# Altium schematic sheet GDRIVE2.SchDoc
size A3
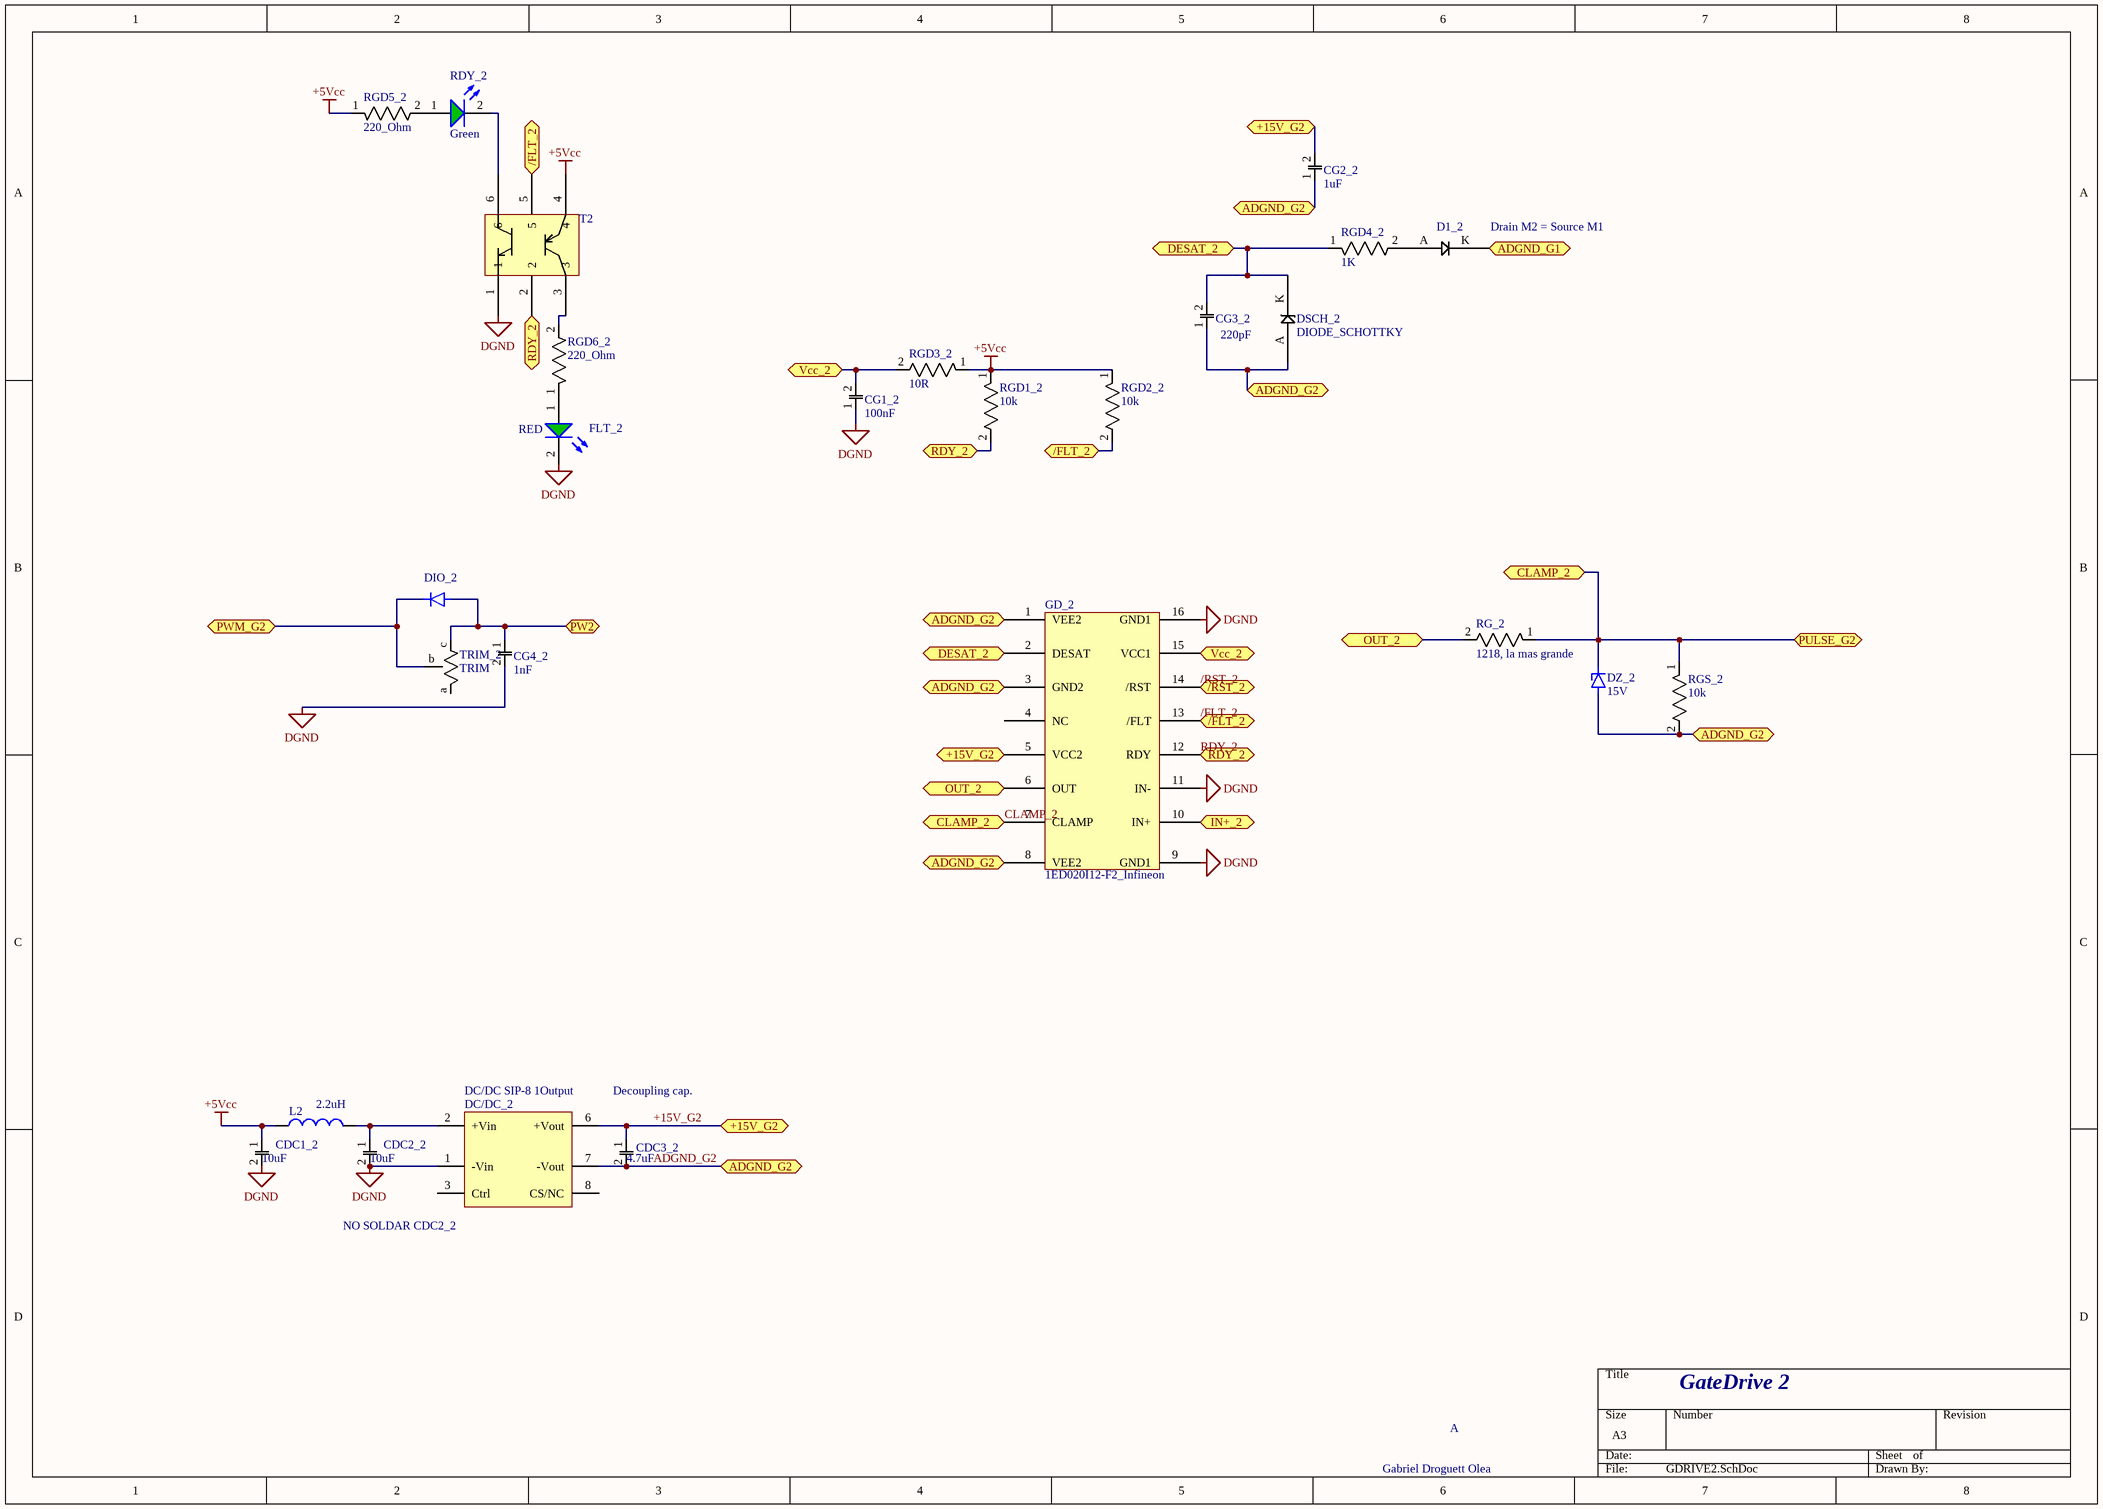
[diagram p0: GDRIVE2.SchDoc]

## Parts
CDC1_2  10uF  [C1206]
CDC2_2  10uF  [C1206]
CDC3_2  4.7uF  [C1206]
CG1_2  100nF  [CAP_0805_L]
CG2_2  1uF  [CAP_0603]
CG3_2  220pF  [CAP_0603]
CG4_2  1nF  [CAP_0805]
D1_2  DIODE  [DO-214AC]  (value not drawn)
DC/DC_2  DC/DC SIP-8 1Output  [DC/DC SIP-8]
DIO_2  DIOde  [DIO_BAS85-GS08]  (value not drawn)
DSCH_2  DIODE_SCHOTTKY  [SOD323W]
DZ_2  15V  [BZV55-C15,115]
FLT_2  RED  [LED_0805]
GD_2  1ED020I12-F2_Infineon  [SOIC_16W]
L2  2.2uH  [RES_0805]
RDY_2  Green  [LED_0805]
RG_2  1218, la mas grande  [RES_1218]
RGD1_2  10k  [0603]
RGD2_2  10k  [0603]
RGD3_2  10R  [RES_1206]
RGD4_2  1K  [RES_0805]
RGD5_2  220_Ohm  [res_0805]
RGD6_2  220_Ohm  [res_0805]
RGS_2  10k  [RES_1206]
T2  TRANS PREBIAS  [SOT363_]  (value not drawn)
TRIM_2  TRIM  [TRIM_TS53YJ203MR10]

## Ports
+15V_G2 (bidir), /FLT_2 (bidir), /RST_2 (bidir), ADGND_G1 (bidir), ADGND_G2 (bidir), CLAMP_2 (bidir), DESAT_2 (bidir), IN+_2 (bidir), OUT_2 (bidir), PULSE_G2 (bidir), PW2 (bidir), PWM_G2 (bidir), RDY_2 (bidir), Vcc_2 (bidir)

## Nets
+5Vcc: CDC1_2.1 L2.1 RGD1_2.1(C) RGD2_2.1(C) RGD3_2.1(C) RGD5_2.1(C) T2.4
DGND: CDC1_2.2 CDC2_2.2 CG1_2.1 CG4_2.2 DC/DC_2.1(-Vin) FLT_2.2(C) GD_2.9(GND1) GD_2.11(IN-) GD_2.16(GND1) T2.1
+15V_G2: CDC3_2.1 CG2_2.2 DC/DC_2.6(+Vout) GD_2.5(VCC2) ; port +15V_G2
/FLT_2: GD_2.13(/FLT) RGD2_2.2(A) T2.5 ; port /FLT_2
/RST_2: GD_2.14(/RST) ; port /RST_2
ADGND_G1: D1_2.K ; port ADGND_G1
ADGND_G2: CDC3_2.2 CG2_2.1 CG3_2.1 DC/DC_2.7(-Vout) DSCH_2.A DZ_2.2(Anodo) GD_2.1(VEE2) GD_2.3(GND2) GD_2.8(VEE2) RGS_2.2(A) ; port ADGND_G2
CLAMP_2: DZ_2.1(Catodo) GD_2.7(CLAMP) RG_2.1(C) RGS_2.1(C) ; port CLAMP_2, port PULSE_G2
DESAT_2: CG3_2.2 DSCH_2.K GD_2.2(DESAT) RGD4_2.1(C) ; port DESAT_2
IN+_2: GD_2.10(IN+) ; port IN+_2
OUT_2: GD_2.6(OUT) RG_2.2(A) ; port OUT_2
PW2: CG4_2.1 DIO_2.2(Anodo) TRIM_2.c ; port PW2
PWM_G2: DIO_2.1(Catodo) TRIM_2.b ; port PWM_G2
RDY_2: GD_2.12(RDY) RGD1_2.2(A) T2.2 ; port RDY_2
Vcc_2: CG1_2.2 GD_2.15(VCC1) RGD3_2.2(A) ; port Vcc_2
NetCDC2_2_1: CDC2_2.1 DC/DC_2.2(+Vin) L2.2
NetD1_2_A: D1_2.A RGD4_2.2(A)
NetFLT_2_1: FLT_2.1(A) RGD6_2.1(C)
NetRDY_2_1: RDY_2.1(A) RGD5_2.2(A)
NetRDY_2_2: RDY_2.2(C) T2.6
NetRGD6_2_2: RGD6_2.2(A) T2.3

Not connected (* = marked no-connect by the designer): DC/DC_2 3(Ctrl) 8(CS/NC); GD_2 4(NC); TRIM_2 a

## Notes on the sheet
- (near D1_2) Drain M2 = Source M1
- Decoupling cap.
- (near DC/DC_2) NO SOLDAR CDC2_2
- GateDrive 2
- A
- Gabriel Droguett Olea

## Library data of the parts
CDC1_2 CDC2_2 = CAP_C0805C105Z3VACTU: CAP CER 10UF 35V X6S 1206; Manufacturer Part Number: C3216X6S1V106K160AC; Digi-Key Part Number: 445-14778-1-ND; RS Part Number: 723-6647
CDC3_2 = CAP_C0805C105Z3VACTU: CAP CER 4.7UF 35V X7R 1206; Manufacturer Part Number: C3216X7R1V475K085AC; Digi-Key Part Number: 445-14805-1-ND; RS Part Number: *
CG1_2 = CAP_0603YC104KAT2A: CAP CER 0.1UF 50V X7R 0805; Manufacturer Part Number: 08055C104KAT2A; Digi-Key Part Number: 478-1395-1-ND; RS Part Number: *
CG2_2 = CAP_0603YC104KAT2A: CAP CER 1UF 50V X5R 0603; Manufacturer Part Number: CGA3E3X5R1H105K080AB; Digi-Key Part Number: 445-7878-1-ND; RS Part Number: *
CG3_2 = CAP_0603YC104KAT2A: CAP CER 220PF 50V C0G/NP0 0603; Manufacturer Part Number: C0603C221F5GACTU; Digi-Key Part Number: 399-7876-1-ND; RS Part Number: *
CG4_2 = CAP_C0805C102J5GACTU: CAP CER 1000PF 50V C0G/NP0 0805; Digi-Key Part Number: 399-1136-1-ND; Manufacturer Part Number: C0805C102J5GACTU; RS Part Number: *
D1_2 = DIODE: DIODE GEN PURP 1KV 1A SMA; Manufacturer Part Number: RS1MTR; Digi-Key Part Number: 1655-1501-1-ND; RS Part Number: *
DIO_2 = DIO_BAS85-GS08: DIODE SCHOTTKY 30V 200MA SOD80; Digi-Key Part Number: BAS85-GS08CT-ND; Manufacturer Part Number: BAS85-GS08; RS Part Number: *
DSCH_2 = DIODE_SCHOTTKY: DIODE SCHOTTKY 40V 750MA SOD323; Manufacturer Part Number: BAT165E6327HTSA1; Digi-Key Part Number: BAT165E6327HTSA1CT-ND; RS Part Number: *
DZ_2 = DIO_BZV55-C15,115: DIODE ZENER 15V 500MW SOD80C; Digi-Key Part Number: 1727-4962-1-ND; Manufacturer Part Number: BZV55-C15,115; RS Part Number: 484-3227
FLT_2 RDY_2 = WL-SMCW 0805  150080GS75000: LED RED CLEAR 0805 SMD; Manufacturer Part Number: 150080RS75000
  FLT_2: Digi-Key Part Number: 732-4984-1-ND; RS Part Number: 815-4225
  RDY_2: Digi-Key Part Number: 732-4986-1-ND
GD_2 = 1ED020I12-F2_Infineon: IC IGBT DVR 1200V 2A DSO16; Manufacturer Part Number: 1ED020I12F2XUMA1; Digi-Key Part Number: 1ED020I12F2XUMA1CT-ND; RS Part Number: 110-9111
L2 = Inductor: FIXED IND 2.2UH 600MA 160 MOHM; Manufacturer Part Number: MLZ2012M2R2HT000; Digi-key Part Number: 445-8658-1-ND; RS Part Number: *
RG_2 = RES_RCL121847R0JNEK: RON 1218; Digi-Key Part Number: *; Manufacturer Part Number: *; RS Part Number: *
RGD1_2 RGD2_2 = RES_RCL121847R0JNEK: RES SMD 10K OHM 0.1% 3/8W 0603; Manufacturer Part Number: PHP00603E1002BST1; Digi-Key Part Number: 764-1103-6-ND; RS Part Number: 818-3052
RGD3_2 = RES_RCL121847R0JNEK: RES SMD 10 OHM 1W 1206 WIDE; Manufacturer Part Number: PRG3216P-10R0-D-T5; Digi-Key Part Number: 408-1809-1-ND; RS Part Number: *
RGD4_2 = RES_RCL121847R0JNEK: RES SMD 1K OHM 0.1% 1W 0805; Manufacturer Part Number: PCAN0805E1001BST5; Digi-Key Part Number: 764-1240-6-ND; RS Part Number: *
RGD5_2 RGD6_2 = RES_ERJ-3GEYJ471V: 1% 1/4W 0805; Manufacturer Part Number: RC0603FR-07220RL; Digi-Key Part Number: 311-220HRCT-ND; RS Part Number: *
RGS_2 = RES_ERJ-8ENF2002V: RES SMD 10K OHM 0-1% 1W 1206; Manufacturer Part Number: PHP01206E1002BST5; Digi-Key Part Number: PHP10.0KADKR_ND; RS Part Number: *
T2 = TRANS PREBIAS: TRANS PREBIAS NPN/PNP SOT666; Manufacturer Part Number: PUMD16,115; Digi-Key Part Number: 1727-3930-1-ND; RS Part Number: 518-3734
TRIM_2 = TRIM_TS53YJ203MR10: TRIMMER 1K OHM 0.25W SMD; Manufacturer Part Number: TS53YJ102MR10; Digi-Key Part Number: TS53YJ-1.0KCT-ND